# EAGLE design MB (EAGLE 8.3.2)
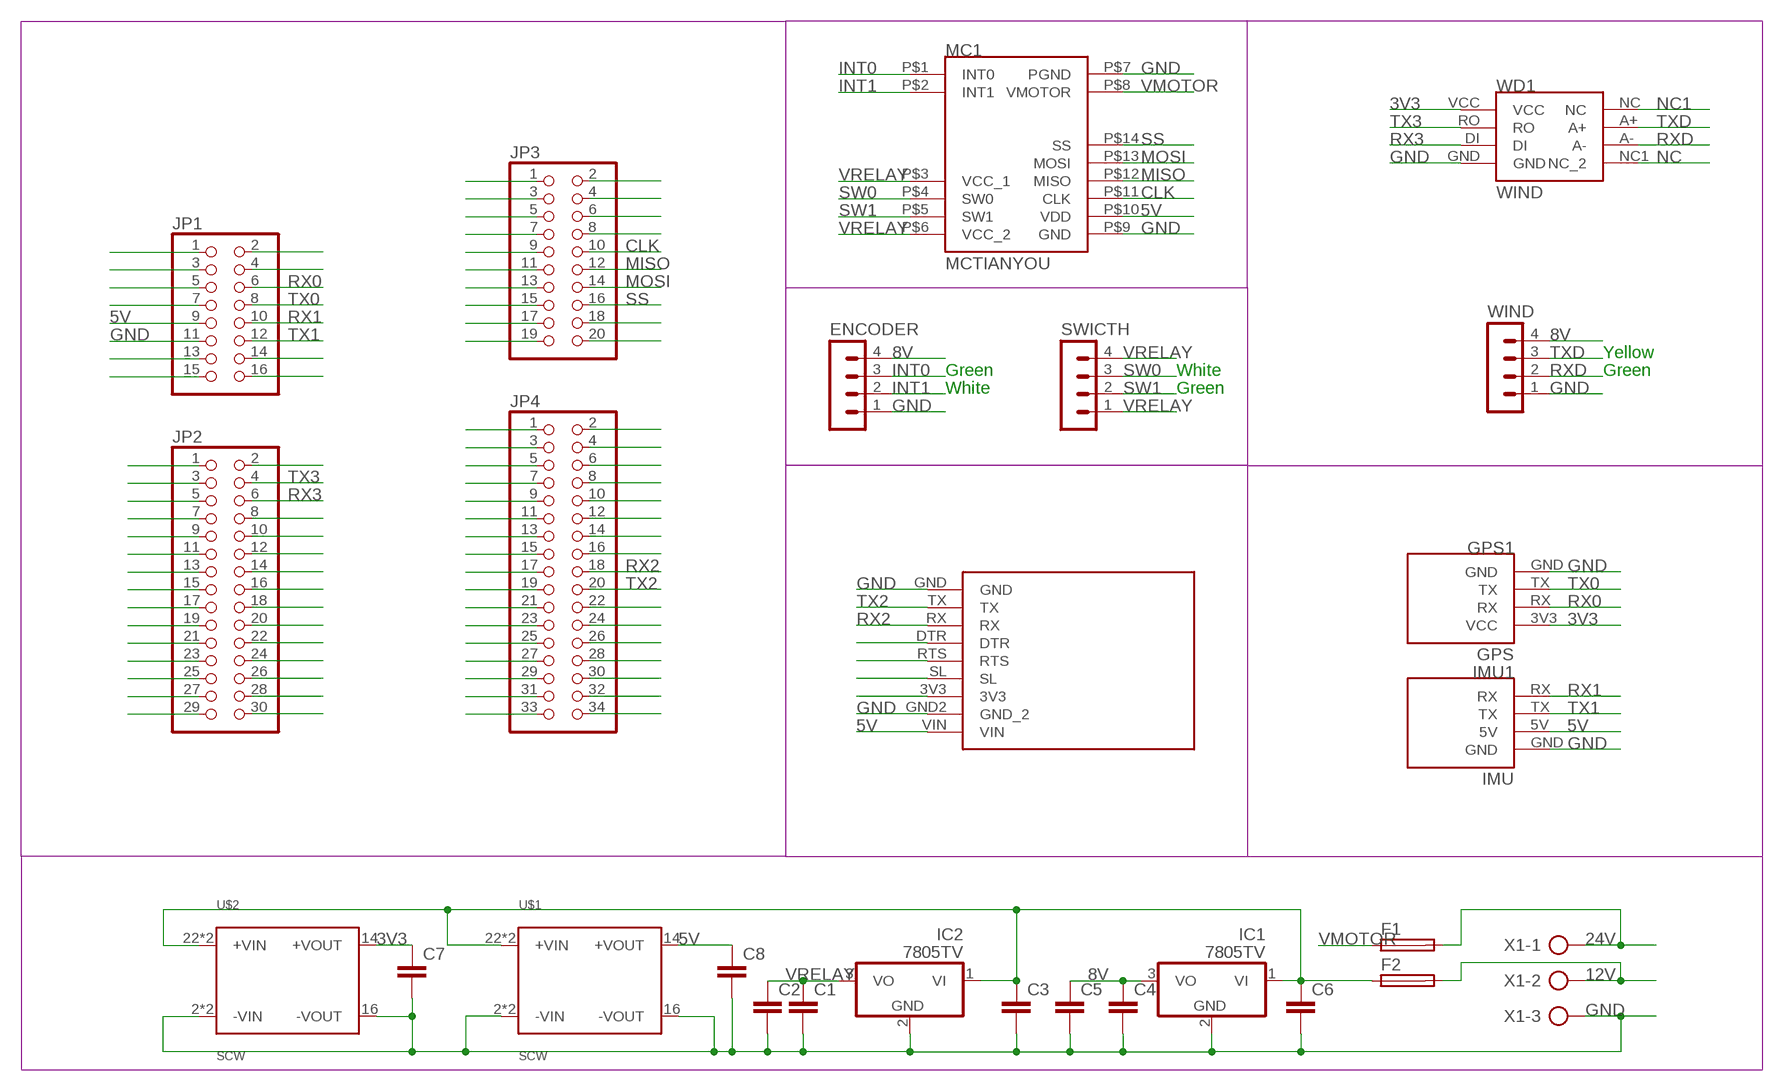
[diagram p0: schematic, sheet 1]

## Parts
C1  C-EUC0603  [C0603]
C2  C-EUC0603  [C0603]
C3  C-EUC0603  [C0603]
C4  C-EUC0603  [C0603]
C5  C-EUC0603  [C0603]
C6  C-EUC0603  [C0603]
C7  C-EUC0603  [C0603]
C8  C-EUC0603  [C0603]
ENCODER  MA04-1  [MA04-1]
F1  SH22,5  [SH22,5]
F2  SH22,5  [SH22,5]
GPS1  GPS  [GPS]
IC1  7805TV  [TO220V]
IC2  7805TV  [TO220V]
IMU1  IMU  [IMU]
JP1  PINHD-2X8  [2X08]
JP2  PINHD-2X15  [2X15]
JP3  PINHD-2X10  [2X10]
JP4  PINHD-2X17  [2X17]
MC1  MCTIANYOU  [MCTIANYOU]
SWICTH  MA04-1  [MA04-1]
U$1  SCW  [SCW]
U$2  SCW  [SCW]
WD1  WIND  [WIND]
WIND  MA04-1  [MA04-1]
X1  AK300/3  [AK300/3]
XBEE1  XBEE  [XBEE]

## Nets
3V3: C7.1 GPS1.3V3(VCC) U$2.14(+VOUT) WD1.VCC
5V: C8.1 IMU1.5V JP1.9 MC1.P$10(VDD) U$1.14(+VOUT) XBEE1.VIN
8V: C4.1 C5.1 ENCODER.4 IC1.3(VO) WIND.4
12V: F2.2 X1.2
24V: F1.2 X1.1
CLK: JP3.10 MC1.P$11(CLK)
GND: C1.2 C2.2 C3.2 C4.2 C5.2 C6.2 C7.2 C8.2 ENCODER.1 GPS1.GND IC1.2(GND) IC2.2(GND) IMU1.GND JP1.11 MC1.P$7(PGND) MC1.P$9(GND) U$1.2(-VIN) U$1.3(-VIN) U$1.16(-VOUT) U$2.2(-VIN) U$2.3(-VIN) U$2.16(-VOUT) WD1.GND WIND.1 X1.3 XBEE1.GND XBEE1.GND2(GND_2)
INT0: ENCODER.3 MC1.P$1(INT0)
INT1: ENCODER.2 MC1.P$2(INT1)
MISO: JP3.12 MC1.P$12(MISO)
MOSI: JP3.14 MC1.P$13(MOSI)
N$1: JP1.1
N$2: JP1.3
N$3: JP1.5
N$4: JP1.7
N$7: JP1.13
N$8: JP1.15
N$9: JP1.2
N$10: JP1.4
N$15: JP1.14
N$16: JP1.16
N$17: JP2.2
N$20: JP2.8
N$21: JP2.10
N$22: JP2.12
N$23: JP2.14
N$24: JP2.16
N$25: JP2.18
N$26: JP2.20
N$27: JP2.22
N$28: JP2.24
N$29: JP2.26
N$30: JP2.28
N$31: JP2.30
N$32: JP2.1
N$33: JP2.3
N$34: JP2.5
N$35: JP2.7
N$36: JP2.9
N$37: JP2.11
N$38: JP2.13
N$39: JP2.15
N$40: JP2.17
N$41: JP2.19
N$42: JP2.21
N$43: JP2.23
N$44: JP2.25
N$45: JP2.27
N$46: JP2.29
N$47: JP3.1
N$48: JP3.3
N$49: JP3.5
N$50: JP3.7
N$51: JP3.9
N$52: JP3.11
N$53: JP3.13
N$54: JP3.15
N$55: JP3.17
N$56: JP3.19
N$57: JP3.2
N$58: JP3.4
N$59: JP3.6
N$60: JP3.8
N$65: JP3.18
N$66: JP3.20
N$67: JP4.1
N$68: JP4.3
N$69: JP4.5
N$70: JP4.7
N$71: JP4.9
N$72: JP4.11
N$73: JP4.13
N$74: JP4.15
N$75: JP4.17
N$76: JP4.19
N$77: JP4.21
N$78: JP4.23
N$79: JP4.25
N$80: JP4.27
N$81: JP4.29
N$82: JP4.31
N$83: JP4.33
N$84: JP4.2
N$85: JP4.4
N$86: JP4.6
N$87: JP4.8
N$88: JP4.10
N$89: JP4.12
N$90: JP4.14
N$91: JP4.16
N$94: JP4.22
N$95: JP4.24
N$96: JP4.26
N$97: JP4.28
N$98: JP4.30
N$99: JP4.32
N$100: JP4.34
N$101: C3.1 C6.1 F2.1 IC1.1(VI) IC2.1(VI) U$1.22(+VIN) U$1.23(+VIN) U$2.22(+VIN) U$2.23(+VIN)
N$116: XBEE1.DTR
N$117: XBEE1.RTS
N$118: XBEE1.SL
N$119: XBEE1.3V3
NC: WD1.NC1(NC_2)
NC1: WD1.NC
RX0: GPS1.RX JP1.6
RX1: IMU1.RX JP1.10
RX2: JP4.18 XBEE1.RX
RX3: JP2.6 WD1.DI
RXD: WD1.A- WIND.2
SS: JP3.16 MC1.P$14(SS)
SW0: MC1.P$4(SW0) SWICTH.3
SW1: MC1.P$5(SW1) SWICTH.2
TX0: GPS1.TX JP1.8
TX1: IMU1.TX JP1.12
TX2: JP4.20 XBEE1.TX
TX3: JP2.4 WD1.RO
TXD: WD1.A+ WIND.3
VMOTOR: F1.1 MC1.P$8(VMOTOR)
VRELAY: C1.1 C2.1 IC2.3(VO) MC1.P$3(VCC_1) MC1.P$6(VCC_2) SWICTH.1 SWICTH.4

## Notes on the sheet
- Yellow
- Green | White | Green
- White | Green

## Library data of the parts
C1-C8 = rcl:C-EU: CAPACITOR, European symbol
ENCODER SWICTH WIND = con-lstb:MA04-1: PIN HEADER; OC_FARNELL: unknown; OC_NEWARK: unknown
F1 F2 = fuse:SH22,5: FUSE HOLDER grid 22,5 mm, OGN0031 8201, Schurter (Buerklin); MF: SCHURTER; MPN: 0031.8201; OC_FARNELL: 1162740; OC_NEWARK: 96F8317
GPS1 = mine:GPS
IC1 IC2 = linear:78*: Positive VOLTAGE REGULATOR Source: http://cache.national.com/ds/LM/LM78L05.pdf http://www.fairchildsemi.com/ds/LM/LM7805.pdf
IMU1 = mine:IMU
JP1 = pinhead:PINHD-2X8: PIN HEADER
JP2 = pinhead:PINHD-2X15: PIN HEADER
JP3 = pinhead:PINHD-2X10: PIN HEADER
JP4 = pinhead:PINHD-2X17: PIN HEADER
MC1 = mine:MCTIANYOU
U$1 U$2 = meanwell_dcdc_v8:SCW: SCW Constant Voltage SCW[Power][Vin]-[Vout] Power: 03= 3 watt 05= 5 watt 08= 8 watt Vin: A= 9 - 18V B= 18 - 36V C= 36 - 72V Vout: 05= 5V 09= 9V (not 3 or 8 watt) 12= 12V 15= 15V Currents: 3 watt: 5V= 60 - 600mA 12V= 25 - 250mA 15V= 20 - 200mA 5 watt: 5V= 200 - 1000mA 9V= 111 - 556mA 12V= 94 - 470mA 15V= 80 - 400mA 8 watt: 5V= 320 - 1600mA 12V= 134 - 670mA 15V= 106 - 533mA
WD1 = mine:WIND
X1 = con-ptr500:AK300/3: CONNECTOR; OC_FARNELL: unknown; OC_NEWARK: unknown
XBEE1 = mine:XBEE

## Board
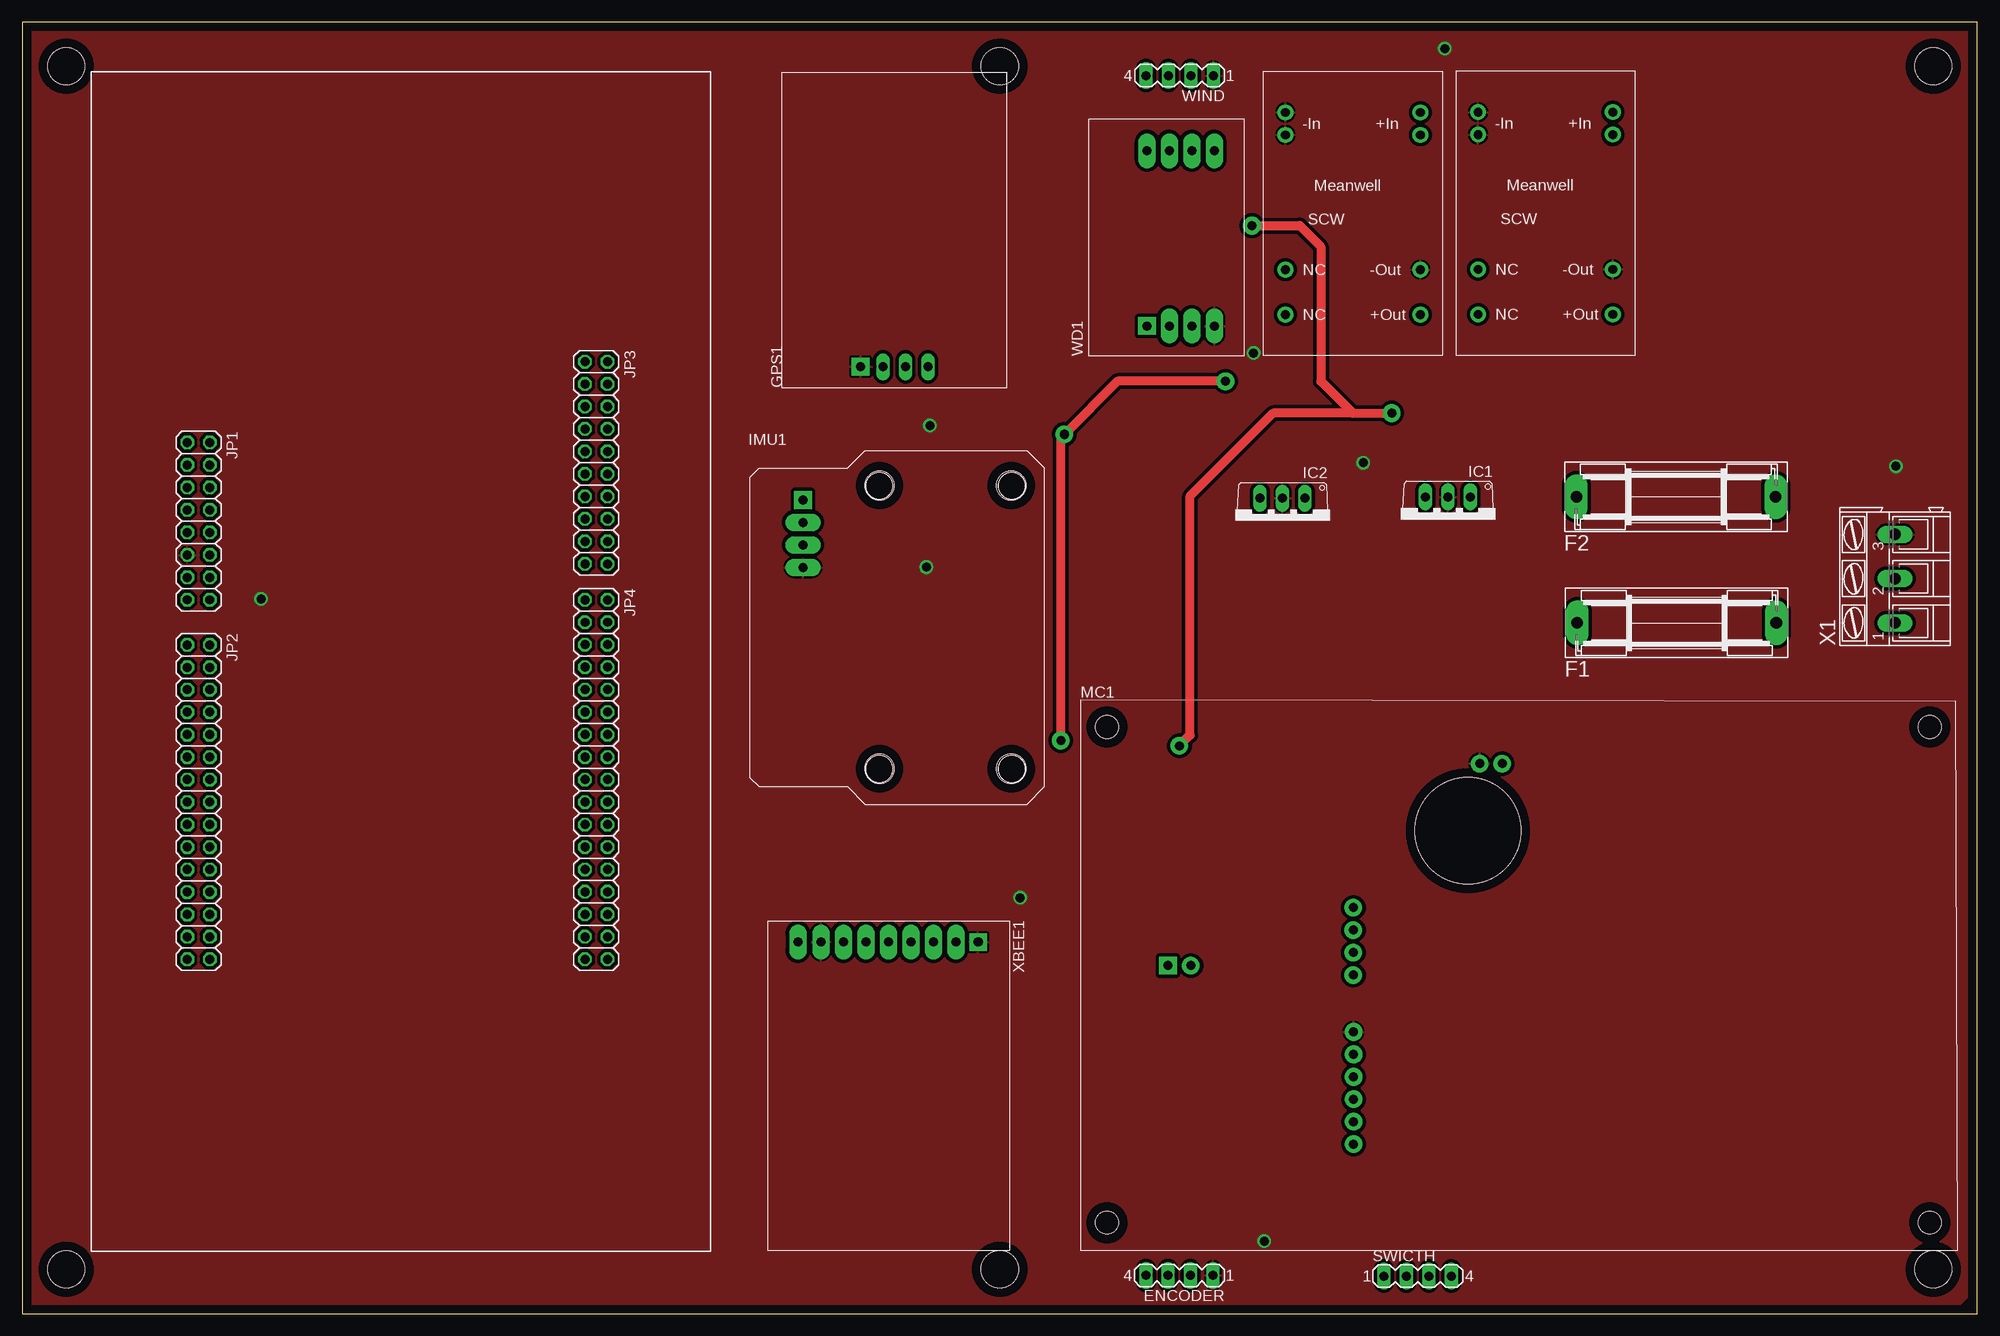
[diagram p1: board, top side]
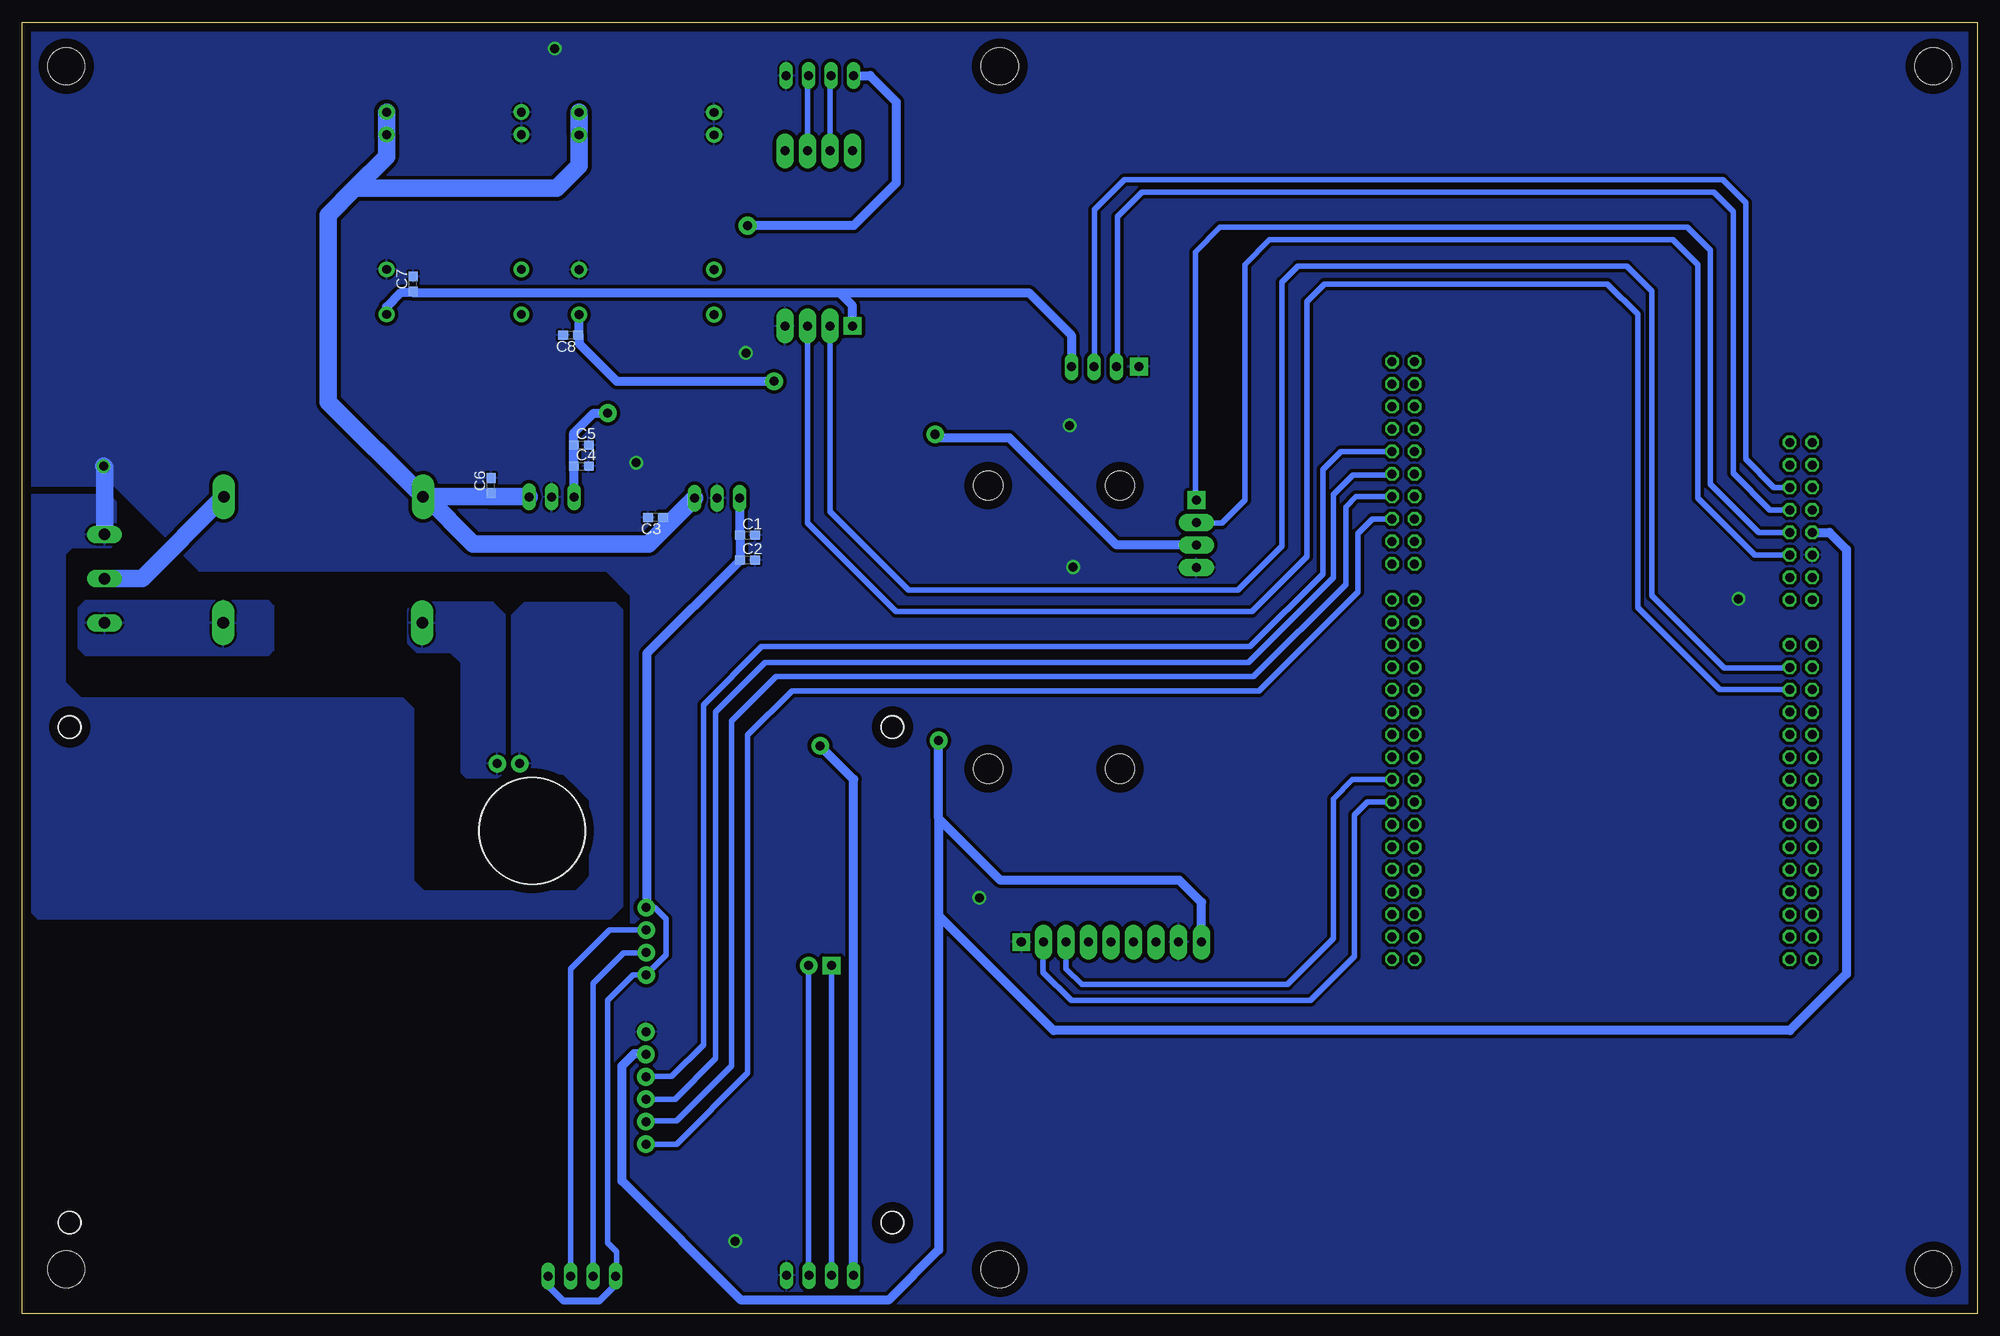
[diagram p2: board, bottom side, seen from below]

Size 221 x 146 mm. Coordinates in mm from the lower left corner, seen from the top.
Outline: 0,0 221,0 221,146 0,146 0,0
Copper layers (1*16): Top 0.035mm / dielectric 1.5mm / Bottom 0.035mm
Design rules "default": minimum track width 6mil, minimum drill 0.35mm, track to track 6mil, track to pad 6mil, pad to pad 6mil, via to via 6mil, smd to smd 6mil, copper to edge 40mil, drill to drill 6mil, minimum pad ring 10mil, minimum via ring 8mil, stop-mask expansion 4mil, vias tented up to drill 0mil, thermal gap 10mil
Holes 3.3 mm at 96.9,93.6 111.8,93.6 96.9,61.6 111.8,61.6
Holes 2.6 mm at 122.6,66.3 215.6,66.3 215.6,10.3 122.6,10.3
Holes 4.2 mm at 5,141 110.5,141 216,141 5,5 110.5,5 216,5
Holes 12 mm at 163.4,54.6

### Footprints (pad centres in the part's own frame; a part is rotated, then mirrored left to right if it is on the bottom)
C0603 = smd 1.1 x 1: 1 -0.85,0; 2 0.85,0
MA04-1 = drill 1.016 long: 1 -3.81,0; 2 -1.27,0; 3 1.27,0; 4 3.81,0
SH22,5 = drill 1.321 pad 2.54 long: 1 -11.252,0; 2 11.252,0
GPS = drill 1.02 long: 3V3 2.4,8.94; RX 2.4,11.48; TX 2.4,14.02 | drill 1.02 pad 2 square: GND 2.4,16.56
TO220V = drill 1.016 long: 1 -2.54,-2.54; 2 0,-2.54; 3 2.54,-2.54
IMU = drill 1.02 pad 2 long: 5V 6,29.32; GND 6,26.78; TX 6,31.86 | drill 1.02 pad 2 square: RX 6,34.4
2X08 = drill 1.016 octagon: 1 -8.89,-1.27; 2 -8.89,1.27; 3 -6.35,-1.27; 4 -6.35,1.27; 5 -3.81,-1.27; 6 -3.81,1.27; 7 -1.27,-1.27; 8 -1.27,1.27; 9 1.27,-1.27; 10 1.27,1.27; 11 3.81,-1.27; 12 3.81,1.27; 13 6.35,-1.27; 14 6.35,1.27; 15 8.89,-1.27; 16 8.89,1.27
2X15 = drill 1.016 octagon: 1 -17.78,-1.27; 2 -17.78,1.27; 3 -15.24,-1.27; 4 -15.24,1.27; 5 -12.7,-1.27; 6 -12.7,1.27; 7 -10.16,-1.27; 8 -10.16,1.27; 9 -7.62,-1.27; 10 -7.62,1.27; 11 -5.08,-1.27; 12 -5.08,1.27; 13 -2.54,-1.27; 14 -2.54,1.27; 15 0,-1.27; 16 0,1.27; 17 2.54,-1.27; 18 2.54,1.27; 19 5.08,-1.27; 20 5.08,1.27; 21 7.62,-1.27; 22 7.62,1.27; 23 10.16,-1.27; 24 10.16,1.27; 25 12.7,-1.27; 26 12.7,1.27; 27 15.24,-1.27; 28 15.24,1.27; 29 17.78,-1.27; 30 17.78,1.27
2X10 = drill 1.016 octagon: 1 -11.43,-1.27; 2 -11.43,1.27; 3 -8.89,-1.27; 4 -8.89,1.27; 5 -6.35,-1.27; 6 -6.35,1.27; 7 -3.81,-1.27; 8 -3.81,1.27; 9 -1.27,-1.27; 10 -1.27,1.27; 11 1.27,-1.27; 12 1.27,1.27; 13 3.81,-1.27; 14 3.81,1.27; 15 6.35,-1.27; 16 6.35,1.27; 17 8.89,-1.27; 18 8.89,1.27; 19 11.43,-1.27; 20 11.43,1.27
2X17 = drill 1.016 octagon: 1 -20.32,-1.27; 2 -20.32,1.27; 3 -17.78,-1.27; 4 -17.78,1.27; 5 -15.24,-1.27; 6 -15.24,1.27; 7 -12.7,-1.27; 8 -12.7,1.27; 9 -10.16,-1.27; 10 -10.16,1.27; 11 -7.62,-1.27; 12 -7.62,1.27; 13 -5.08,-1.27; 14 -5.08,1.27; 15 -2.54,-1.27; 16 -2.54,1.27; 17 0,-1.27; 18 0,1.27; 19 2.54,-1.27; 20 2.54,1.27; 21 5.08,-1.27; 22 5.08,1.27; 23 7.62,-1.27; 24 7.62,1.27; 25 10.16,-1.27; 26 10.16,1.27; 27 12.7,-1.27; 28 12.7,1.27; 29 15.24,-1.27; 30 15.24,1.27; 31 17.78,-1.27; 32 17.78,1.27; 33 20.32,-1.27; 34 20.32,1.27
MCTIANYOU = drill 1.02 pad 2 square: P$1 -38.01,9.59 | drill 1.02 pad 2: P$2 -35.43,9.59; P$3 -17.07,16.14; P$4 -17.07,13.6; P$5 -17.07,11.06; P$6 -17.07,8.52; P$7 -2.78,32.41; P$8 -0.24,32.41; P$9 -17.04,2.1; P$10 -17.04,-0.44; P$11 -17.04,-2.98; P$12 -17.04,-5.52; P$13 -17.04,-8.06; P$14 -17.04,-10.6
SCW = drill 1 pad 1.778: 2 -7.62,11.43; 3 -7.62,8.89; 9 -7.62,-6.35; 11 -7.62,-11.43; 14 7.62,-11.43; 16 7.62,-6.35; 22 7.62,8.89; 23 7.62,11.43
WIND = drill 1.02 pad 2 long: A+ 23.2,8.48; A- 23.2,5.94; DI 3.4,5.94; GND 3.4,3.4; NC 23.2,11.02; NC1 23.2,3.4; RO 3.4,8.48 | drill 1.02 pad 2 square: VCC 3.4,11.02
AK300/3 = drill 1.321 long: 1 -5.004,0; 2 0,0; 3 5.004,0
XBEE = drill 1.02 pad 2 long: 3V3 2.4,8.6; DTR 2.4,16.22; GND2 2.4,6.06; RTS 2.4,13.68; RX 2.4,18.76; SL 2.4,11.14; TX 2.4,21.3; VIN 2.4,3.46 | drill 1.02 pad 2 square: GND 2.4,23.84

### Placement (x,y rotation side)
C1  139,88 0 bottom
C2  139,85.2 0 bottom
C3  149.4,90 180 bottom
C4  157.8,95.8 0 bottom
C5  157.8,98.2 0 bottom
C6  168,93.6 90 bottom
C7  176.8,116.4 90 bottom
C8  159,110.6 180 bottom
ENCODER  130.81,4.33 180 top
F1  187.02,78.09 0 top
F2  186.94,92.34 0 top
GPS1  111.33,104.65 90 top
IC1  161.17,89.79 180 top
IC2  142.46,89.65 180 top
IMU1  82.27,57.58 0 top
JP1  19.93,89.59 270 top
JP2  19.93,57.83 270 top
JP3  64.89,96.19 270 top
JP4  64.89,60.38 270 top
MC1  167.53,29.76 0 top
SWICTH  157.74,4.25 0 top
U$1  150.42,124.36 0 top
U$2  172.19,124.4 0 top
WD1  138.16,108.25 90 top
WIND  130.84,139.96 180 top
X1  211.69,83.09 90 top
XBEE1  84.23,44.41 270 top

### Tracks (layer width: path | path; a pad name or v marks a point on that pad's centre or on a via)
3V3
  Bottom 1: U$2.14 179.81,113.79 178.2,115.4 176.8,115.4 | 176.8,115.4 128.6,115.4 | 128.6,115.4 107.2,115.4 102.4,110.6 GPS1.3V3 | WD1.VCC 127.14,113.94 128.6,115.4 | C7.1 176.8,115.4
5V  (via drill 1.02 pad 2)
  Top 1: v136,105.4 123.8,105.4 v117.8,99.4 117.4,99 v117.4,64.8
  Bottom 1: 158.04,110.6 U$1.14 | 158.04,110.6 158.04,109.64 153.8,105.4 v136,105.4 | 88.37,87 IMU1.5V 97.3,86.9 109.4,99 117.4,99 v117.8,99.4 | JP1.9 16.72,88.32 14.8,86.4 14.8,38.4 21.2,32 104.4,32 117.4,45 117.4,48.6 | 117.4,56 117.4,48.6 | 117.4,56 v117.4,64.8 | XBEE1.VIN 87.69,46.49 90.2,49 110.4,49 117.4,56 | C8.1 158.04,110.6 | 117.4,48.6 117.4,7.2 123.08,1.52 139.72,1.52 153.2,15 153.2,28 151.8,29.4 150.57,29.4 MC1.P$10
8V  (via drill 1.02 pad 2)
  Top 1: v130.8,64.2 132,65.4 132,92.4 141.4,101.8 150.4,101.8 | 150.4,101.8 v154.8,101.8 | v139,123 144.4,123 146.8,120.6 146.8,105.4 150.4,101.8
  Bottom 1: IC1.3 158.63,95.78 C4.1 C5.1 158.65,99.55 156.4,101.8 v154.8,101.8 | WIND.4 125.16,139.96 122.2,137 122.2,127.8 127,123 v139,123 | ENCODER.4 127,60.4 v130.8,64.2
12V
  Bottom 2: X1.2 207.44,83.09 F2.2
24V
  pour Bottom (isolate 0.4): 213.6,80.6 193.2,80.6 192.6,80 192.6,75 193.2,74.4 213.8,74.4 214.6,75.2 214.6,79.8 213.8,80.6
CLK
  Bottom 0.6: JP3.10 71.94,97.46 74,95.4 74,83.6 82.2,75.4 137.4,75.4 144,68.8 144,30.4 147.6,26.8 150.47,26.8 MC1.P$11
GND  (via drill 1.02)
  Bottom 2: X1.3 211.69,95.69 v211.8,95.8
  other vias: 160.8,143 151.6,96.2 140.4,8.2 112.8,47 27,80.8 102.2,84.4 139.2,108.6 102.6,100.4
  pour Bottom (isolate 0.4): 221,146 221,93.6 210.6,93.6 201,84 155,84 152.2,81.2 152.2,43.6 154,41.8 219.2,41.8 220,41 220,2 218,0 1.6,0 0,1.6 0,145 1,146
  pour Top (isolate 0.4): 0,145 1,146 219.6,146 221,144.6 221,3 218,0 1.6,0 0,1.6
  pour Bottom (isolate 0.4): 165,60.6 165.2,60.6 165.6,61 165.6,79 164.2,80.4 154,80.4 153.2,79.6 153.2,46 154.4,44.8 154.6,44.6 219.2,44.6 220.8,46.2 220.8,91.8 220,92.6 211.2,92.6 210.4,91.8 210.4,87.2 211,86.6 215.4,86.6 216.2,85.8 216.2,71.4 214.4,69.6 178,69.6 176.8,68.4 176.8,49 175.6,47.8 158.4,47.8 157.2,49 156.8,49.4 156.8,58 159.2,60.4 159.8,61 164.4,61 164.6,61
INT0
  Bottom 0.6: MC1.P$1 129.52,4.35 ENCODER.3
INT1
  Bottom 0.6: MC1.P$2 132.1,4.35 ENCODER.2
MISO
  Bottom 0.6: 147.2,24.24 MC1.P$12 | 147.2,24.24 147.16,24.24 | 72.8,84.2 72.8,84.6 | 72.8,84.6 72.8,92.6 70.6,94.8 66.28,94.8 JP3.12 | 147.2,24.24 142.6,28.84 142.6,68 137,73.6 82.4,73.6 72.8,83.2 72.8,84.6
MOSI
  Bottom 0.6: JP3.14 70.22,92.38 71.4,91.2 71.4,82.4 81.8,72 135.8,72 140.8,67 140.8,28 147,21.8 150.39,21.8 MC1.P$13
N$101
  Bottom 1: C3.1 148,90 147.59,89.59 | C6.1 168,92.34
  Bottom 2: F2.1 168,92.34 IC1.1 | F2.1 175.34,92.34 170,87 150.19,87 147.59,89.59 IC2.1 | 183.4,127.2 160.6,127.2 158.04,129.76 U$1.23 U$1.22 | 183.4,127.2 186.4,124.2 186.4,103.05 F2.1 | 179.81,133.2 U$2.23 | 179.81,133.2 179.81,130.79 183.4,127.2 | U$2.22 179.81,133.2
RX0
  Bottom 0.6: JP1.6 23,93.4 26.2,96.6 26.2,125.6 28.8,128.2 96.4,128.2 99.8,124.8 99.8,109.2 | 99.8,109.2 99.8,109.6 | 99.8,109.2 99.8,107.1 GPS1.RX
RX1
  Bottom 0.6: JP1.10 24.72,88.32 30.2,93.8 30.2,120.2 32.8,122.8 85.6,122.8 88.4,120 88.4,92.11 IMU1.RX
RX2
  Bottom 0.6: JP4.18 70.62,60.38 72.8,58.2 72.8,42.4 78,37.2 101.2,37.2 103,39 XBEE1.RX
RX3
  Bottom 0.6: JP2.6 29.13,70.53 38.4,79.8 38.4,113 41.8,116.4 73.8,116.4 75.8,114.4 75.8,85.6 82,79.4 122.2,79.4 132.2,89.4 132.2,111.63 WD1.DI
RXD
  Bottom 0.6: WD1.A- 132.22,139.85 WIND.2
SS
  Bottom 0.6: MC1.P$14 147.04,19.16 139,27.2 139,65.4 134,70.4 81.2,70.4 70,81.6 70,88.2 68.4,89.8 66.2,89.8 JP3.16
SW0
  Bottom 0.6: SWICTH.3 159.01,38.99 154.6,43.4 150.5,43.4 MC1.P$4
SW1
  Bottom 0.6: SWICTH.2 156.47,37.33 153,40.8 150.48,40.8 MC1.P$5
TX0
  Bottom 0.6: JP1.8 23.46,90.86 27.6,95 27.6,124.6 29.8,126.8 94.4,126.8 97.2,124 97.2,107.16 GPS1.TX
TX1
  Bottom 0.6: JP1.12 25.18,85.78 31.6,92.2 31.6,118.6 34.4,121.4 80,121.4 82.8,118.6 82.8,92 85.4,89.4 88.4,89.4 88.8,89.8 88.63,89.8 IMU1.TX
TX2
  Bottom 0.6: JP4.20 68.96,57.84 70.4,56.4 70.4,40.4 75.4,35.4 102.4,35.4 105.6,38.6 105.6,41.94 XBEE1.TX
TX3
  Bottom 0.6: WD1.RO 129.68,90.68 120.8,81.8 83.6,81.8 78.6,86.8 78.6,116.6 76.8,118.4 39.6,118.4 36.8,115.6 36.8,81.2 28.6,73 21.28,73 JP2.4
TXD
  Bottom 0.6: WD1.A+ 129.68,139.85 WIND.3
VMOTOR
  pour Bottom (isolate 0.4): 167.4,60.6 166.8,60.6 166.4,61 166.4,79 167.8,80.4 176.6,80.4 177.4,79.6 177.4,75.8 176.4,74.8 172.6,74.8 171.4,73.6 171.4,61.2 170.8,60.6
VRELAY
  Bottom 0.6: SWICTH.1 153.8,4.38 153.8,7 154.8,8 154.8,35.4 151.92,38.28 MC1.P$6 148.2,40.54 148.2,44.6 149.5,45.9 MC1.P$3
  Bottom 0.8: SWICTH.1 153.93,3.27 155.78,1.42 159.82,1.42 161.6,3.2 161.6,4.2 SWICTH.4
  Bottom 1: MC1.P$3 150.4,45.96 150.4,74.6 139.85,85.15 C2.1 C1.1 139.92,88.07 IC2.3